# EAGLE design usb_to_serial_square (EAGLE 5.09)
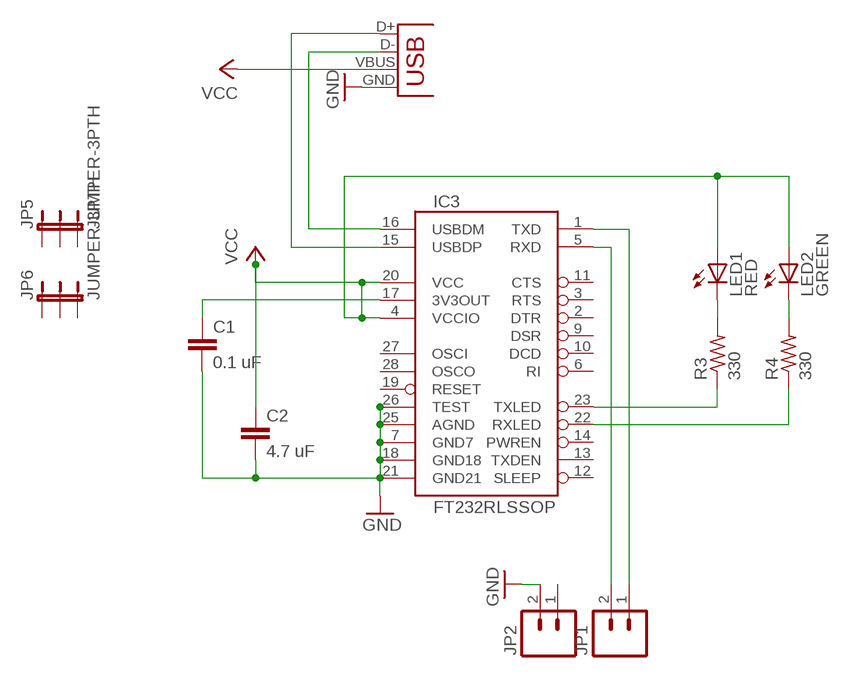
[diagram p0: schematic, sheet 1]

## Parts
C1  0.1 uF  C5/3.5  [C5B3.5]
C2  4.7 uF  C2,5-3  [C2.5-3]
IC3  FT232RLSSOP  [SSOP28DB]
JP1  M02PTH  [1X02]
JP2  M02PTH  [1X02]
JP5  JUMPER-3PTH  [1X03]
JP6  JUMPER-3PTH  [1X03]
LED1  RED  LED3MM  [LED3MM]
LED2  GREEN  LED3MM  [LED3MM]
R3  330  R-US_0207/10  [0207/10]
R4  330  R-US_0207/10  [0207/10]
X1  USBPTH  [USB-B-PTH]

## Nets
GND: C1.2 C2.2 IC3.7(GND7) IC3.18(GND18) IC3.21(GND21) IC3.25(AGND) IC3.26(TEST) JP2.2 X1.GND
N$1: IC3.1(TXD) JP1.1
N$2: IC3.5(RXD) JP1.2
N$13: IC3.15(USBDP) X1.D+
N$14: IC3.16(USBDM) X1.D-
N$15: IC3.23(TXLED) R3.1
N$16: C1.1 IC3.17(3V3OUT)
N$17: IC3.22(RXLED) R4.1
N$18: LED1.K(C) R3.2
N$19: LED2.K(C) R4.2
VCC: C2.1 IC3.4(VCCIO) IC3.20(VCC) LED1.A LED2.A X1.VBUS
Unconnected: IC3.2(DTR) IC3.3(RTS) IC3.6(RI) IC3.9(DSR) IC3.10(DCD) IC3.11(CTS) IC3.12(SLEEP) IC3.13(TXDEN) IC3.14(PWREN) IC3.19(RESET) IC3.27(OSCI) IC3.28(OSCO) JP2.1 JP5.1 JP5.2 JP5.3 JP6.1 JP6.2 JP6.3

## Library data of the parts
C1 C2 = capacitor-wima:C: CAPACITOR naming: grid - package width
IC3 = SparkFun:FT232RL: USB UART FT232RL 4th Generation USB UART (USB <-> Serial) Controller. Spark Fun Electronics SKU : COM-00650
JP1 JP2 = SparkFun:M02: Header 2 Standard 2-pin 0.1" header. Use with straight break away headers (SKU : PRT-00116), right angle break away headers (PRT-00553), swiss pins (PRT-00743), machine pins (PRT-00117), and female headers (PRT-00115). Molex polarized connector foot print use with SKU : PRT-08233 with associated crimp pins and housings.
JP5 JP6 = SparkFun:JUMPER-3
LED1 LED2 = led:LED: LED OSRAM: - CHIPLED LG R971, LG N971, LY N971, LG Q971, LY Q971, LO R971, LY R971 LH N974, LH R974 LS Q976, LO Q976, LY Q976 LO Q996 - Hyper CHIPLED LW Q18S LB Q993, LB Q99A, LB R99A - SideLED LS A670, LO A670, LY A670, LG A670, LP A670 LB A673, LV A673, LT A673, LW A673 LH A674 LY A675 LS A676, LA A676, LO A676, LY A676, LW A676 LS A679, LY A679, LG A679 - Hyper Micro SIDELED® LS Y876, LA Y876, LO Y876, LY Y876 LT Y87S - SmartLED LW L88C, LW L88S LB L89C, LB L89S, LG L890 LS L89K, LO L89K, LY L89K LS L896, LA L896, LO L896, LY L896 - TOPLED LS T670, LO T670, LY T670, LG T670, LP T670 LSG T670, LSP T670, LSY T670, LOP T670, LYG T670 LG T671, LOG T671, LSG T671 LB T673, LV T673, LT T673, LW T673 LH T674 LS T676, LA T676, LO T676, LY T676, LB T676, LH T676, LSB T676, LW T676 LB T67C, LV T67C, LT T67C, LS T67K, LO T67K, LY T67K, LW E67C LS E67B, LA E67B, LO E67B, LY E67B, LB E67C, LV E67C, LT E67C LW T67C LS T679, LY T679, LG T679 LS T770, LO T770, LY T770, LG T770, LP T770 LB T773, LV T773, LT T773, LW T773 LH T774 LS E675, LA E675, LY E675, LS T675 LS T776, LA T776, LO T776, LY T776, LB T776 LHGB T686 LT T68C, LB T68C - Hyper Mini TOPLED® LB M676 - Mini TOPLED Santana® LG M470 LS M47K, LO M47K, LY M47K Source: http://www.osram.convergy.de LUXEON: - LUMILED® LXK2-PW12-R00, LXK2-PW12-S00, LXK2-PW14-U00, LXK2-PW14-V00 LXK2-PM12-R00, LXK2-PM12-S00, LXK2-PM14-U00 LXK2-PE12-Q00, LXK2-PE12-R00, LXK2-PE12-S00, LXK2-PE14-T00, LXK2-PE14-U00 LXK2-PB12-K00, LXK2-PB12-L00, LXK2-PB12-M00, LXK2-PB14-N00, LXK2-PB14-P00, LXK2-PB14-Q00 LXK2-PR12-L00, LXK2-PR12-M00, LXK2-PR14-Q00, LXK2-PR14-R00 LXK2-PD12-Q00, LXK2-PD12-R00, LXK2-PD12-S00 LXK2-PH12-R00, LXK2-PH12-S00 LXK2-PL12-P00, LXK2-PL12-Q00, LXK2-PL12-R00 Source: www.luxeon.com KINGBRIGHT: KA-3528ASYC Source: www.kingbright.com
R3 R4 = resistor:R-US_: RESISTOR, American symbol
X1 = SparkFun:USB: USB Connectors USB-B-PTH is fully proven SKU : PRT-00139 USB-miniB is fully proven SKU : PRT-00587 USB-A-PCB is untested. USB-A-H is throughly reviewed, but untested. Spark Fun Electronics SKU : PRT-00437 USB-B-SMT is throughly reviewed, but untested. Needs silkscreen touching up. USB-A-S has not been used/tested USB-MB-H has not been used/tested

## Board
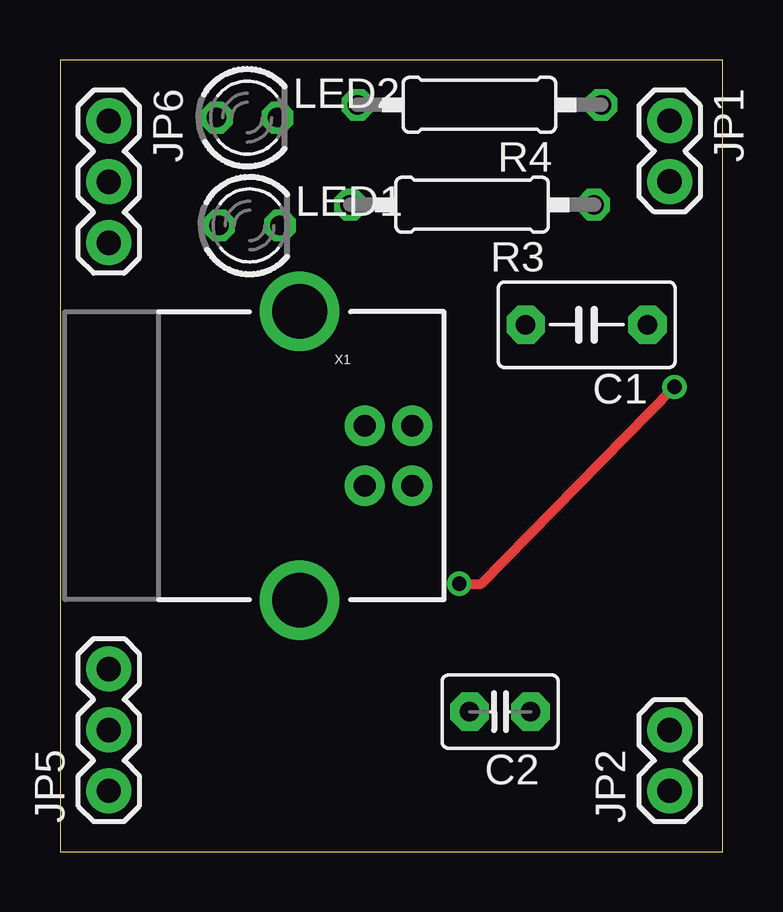
[diagram p1: board, top side]
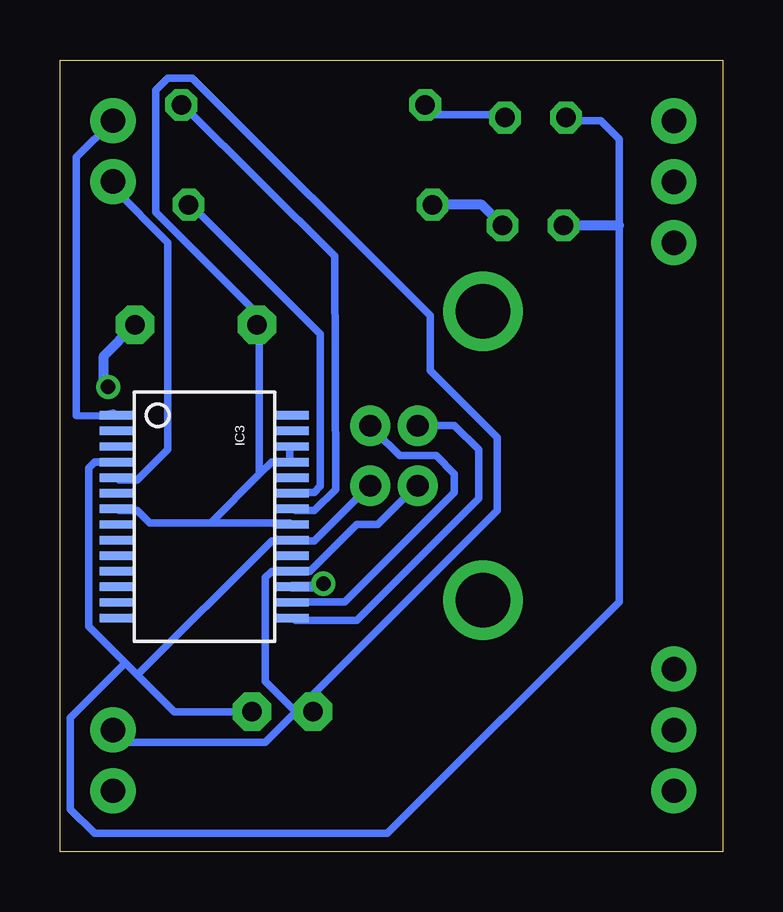
[diagram p2: board, bottom side, seen from below]

Size 27.61 x 33.01 mm. Coordinates in mm from the lower left corner, seen from the top.
Outline: 0,0 27.61,0 27.61,33.01 0,33.01 0,0
Copper layers (1*16): Top 0.035mm / dielectric 1.5mm / Bottom 0.035mm
Design rules "default *": minimum track width 12mil, minimum drill 24mil, track to track 8mil, track to pad 8mil, pad to pad 8mil, via to via 8mil, smd to smd 8mil, copper to edge 20mil, drill to drill 8mil, minimum pad ring 10mil, minimum via ring 8mil, stop-mask expansion 4mil, vias tented up to drill 0mil, thermal gap 10mil

### Footprints (pad centres in the part's own frame; a part is rotated, then mirrored left to right if it is on the bottom)
C5B3.5 = drill 0.813 pad 1.6 octagon: 1 -2.54,0; 2 2.54,0
C2.5-3 = drill 0.813 pad 1.6 octagon: 1 -1.27,0; 2 1.27,0
SSOP28DB = smd 0.348 x 1.397: 1 -4.225,-3.656; 2 -3.575,-3.656; 3 -2.925,-3.656; 4 -2.275,-3.656; 5 -1.625,-3.656; 6 -0.975,-3.656; 7 -0.325,-3.656; 8 0.325,-3.656; 9 0.975,-3.656; 10 1.625,-3.656; 11 2.275,-3.656; 12 2.925,-3.656; 13 3.575,-3.656; 14 4.225,-3.656; 15 4.225,3.656; 16 3.575,3.656; 17 2.925,3.656; 18 2.275,3.656; 19 1.625,3.656; 20 0.975,3.656; 21 0.325,3.656; 22 -0.325,3.656; 23 -0.975,3.656; 24 -1.625,3.656; 25 -2.275,3.656; 26 -2.925,3.656; 27 -3.575,3.656; 28 -4.225,3.656
1X02 = drill 1.016 pad 1.88 round: 1 0,0; 2 2.54,0
1X03 = drill 1.016 pad 1.88 round: 1 0,0; 2 2.54,0; 3 5.08,0
LED3MM = drill 0.813 octagon: A -1.27,0; K 1.27,0
0207/10 = drill 0.813 octagon: 1 -5.08,0; 2 5.08,0
USB-B-PTH = drill 0.914 pad 1.676 round: D+ 0,1.25; D- 1.981,1.25; GND 0,-1.25; VBUS 1.981,-1.25 | drill 2.286 round: P$1 -2.718,-6.02; P$2 -2.718,6.02

### Placement (x,y rotation side)
C1  21.95,21.97 180 top
C2  18.34,5.84 180 top
IC3  21.59,13.97 270 bottom
JP1  25.4,30.48 270 top
JP2  25.4,2.54 90 top
JP5  2.03,2.54 90 top
JP6  2.03,30.47 270 top
LED1  7.9,26.11 0 top
LED2  7.8,30.61 0 top
R3  17.17,26.97 180 top
R4  17.48,31.14 180 top
X1  12.7,16.51 0 top

### Tracks (layer width: path | path; a pad name or v marks a point on that pad's centre or on a via)
GND
  Bottom 0.305: 18.03,16.26 18.03,16.76 IC3.26 | 21.34,13.72 23.88,13.72 24.38,14.22 25.15,14.22 IC3.7 | 21.34,13.72 18.03,13.72 IC3.21 | 18.03,16.26 18.8,16.26 19.3,15.75 | 19.3,15.75 21.34,13.72 | 18.03,16.26 IC3.25 | 19.3,15.75 19.3,21.84 C1.2 19.56,22.1 19.56,22.61 23.62,26.67 23.62,31.75 23.11,32.26 22.1,32.26 12.19,22.35 12.19,20.07 9.4,17.27 9.4,14.22 17.78,5.84 | X1.GND 12.7,15.24 12.78,15.24 14.38,13.64 15.24,13.64 17.2,11.68 17.78,11.68 IC3.18 18.03,11.68 18.8,11.68 19.05,11.43 19.05,7.11 17.78,5.84 | 17.78,5.84 19.05,4.57 24.89,4.57 JP2.2 | C2.2 17.78,5.84
N$1
  Bottom 0.305: JP1.1 26.92,28.96 26.92,18.19 25.93,18.16 25.4,18.29 IC3.1
N$2
  Bottom 0.305: JP1.2 25.4,27.69 23.11,25.4 23.11,16.76 24.38,15.49 25.15,15.49 IC3.5
N$13
  Bottom 0.305: IC3.15 17.78,9.65 15.24,9.65 10.16,14.73 10.16,16.76 11.18,17.78 12.7,17.78 X1.D+
N$14
  Bottom 0.305: IC3.16 17.78,10.41 15.75,10.41 11.18,14.99 11.18,15.75 11.94,16.51 13.46,16.51 14.48,17.53 X1.D-
N$15
  Bottom 0.305: IC3.23 17.78,14.99 17.02,14.99 16.76,15.24 16.76,21.59 22.1,26.92 R3.1
N$16  (via drill 0.6)
  Top 0.406: v16.64,11.18 17.55,11.18 v25.6,19.38
  Bottom 0.406: C1.1 25.78,20.68 25.78,19.48 v25.6,19.38 | IC3.17 16.82,11.05 v16.64,11.18
N$17
  Bottom 0.305: IC3.22 17.78,14.22 17.02,14.22 16.13,15.11 16.15,24.84 22.35,30.99 R4.1
N$18
  Bottom 0.406: R3.2 10.03,26.98 LED1.K
N$19
  Bottom 0.305: LED2.K 9.14,30.73 11.94,30.73 12.19,30.99 R4.2
VCC
  Bottom 0.305: LED2.A 6.35,30.48 5.08,30.48 4.32,29.72 4.32,26.11 4.32,10.41 13.97,0.76 26.16,0.76 27.18,1.78 27.18,5.59 24.89,7.87 | X1.VBUS 14.73,15.24 17.02,12.95 17.78,12.95 IC3.20 18.03,12.95 18.8,12.95 24.38,7.37 | 24.38,7.37 22.86,5.84 C2.1 | 24.89,7.87 24.38,7.37 | 24.89,7.87 26.42,9.4 26.42,16 26.16,16.26 25.4,16.26 IC3.4
  Bottom 0.406: 4.32,26.11 LED1.A